# EAGLE design TeensyRF (EAGLE 6.6.0)
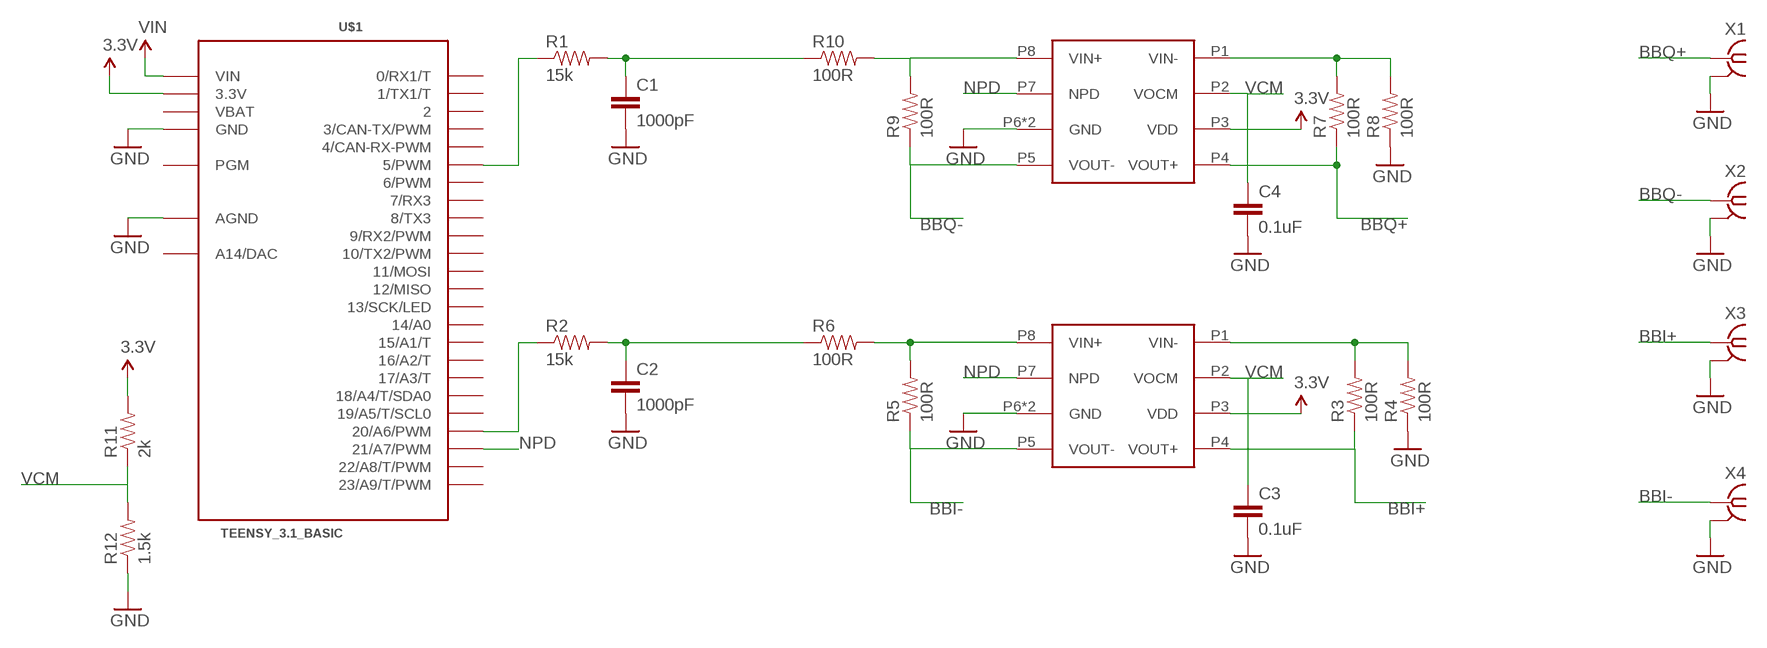
[diagram p0: schematic, sheet 1]

## Parts
C1  1000pF  CAP0805  [0805]
C2  1000pF  CAP0805  [0805]
C3  0.1uF  CAP0805  [0805]
C4  0.1uF  CAP0805  [0805]
R1  15k  RESISTOR0805-RES  [0805]
R2  15k  RESISTOR0805-RES  [0805]
R3  100R  RESISTOR0805-RES  [0805]
R4  100R  RESISTOR0805-RES  [0805]
R5  100R  RESISTOR0805-RES  [0805]
R6  100R  RESISTOR0805-RES  [0805]
R7  100R  RESISTOR0805-RES  [0805]
R8  100R  RESISTOR0805-RES  [0805]
R9  100R  RESISTOR0805-RES  [0805]
R10  100R  RESISTOR0805-RES  [0805]
R11  2k  RESISTOR0805-RES  [0805]
R12  1.5k  RESISTOR0805-RES  [0805]
U$1  TEENSY_3.1_BASIC  [TEENSY_3.1_BASIC]
U$2  THS4120  [POWERPAD-MSOP-8]
U$3  THS4120  [POWERPAD-MSOP-8]
X1  SMA-142-0701-801/806  [J502-ND-142-0701-801/806]
X2  SMA-142-0701-801/806  [J502-ND-142-0701-801/806]
X3  SMA-142-0701-801/806  [J502-ND-142-0701-801/806]
X4  SMA-142-0701-801/806  [J502-ND-142-0701-801/806]

## Nets
3.3V: R11.2 U$1.3.3V U$1.3.3V1(3.3V) U$2.P3(VDD) U$3.P3(VDD)
BBI+: R3.1 U$3.P4(VOUT+) X3.1
BBI-: R5.1 U$3.P5(VOUT-) X4.1
BBQ+: R7.1 U$2.P4(VOUT+) X1.1
BBQ-: R9.1 U$2.P5(VOUT-) X2.1
GND: C1.2 C2.2 C3.2 C4.2 R4.1 R8.1 R12.1 U$1.AGND U$1.GND U$1.GND1(GND) U$2.P6(GND) U$2.PAD(GND) U$3.P6(GND) U$3.PAD(GND) X1.G@1 X1.G@2 X1.G@3 X1.G@4 X2.G@1 X2.G@2 X2.G@3 X2.G@4 X3.G@1 X3.G@2 X3.G@3 X3.G@4 X4.G@1 X4.G@2 X4.G@3 X4.G@4
N$1: R1.1 U$1.5(5/PWM)
N$2: C1.1 R1.2 R10.1
N$3: R2.1 U$1.20/A6(20/A6/PWM)
N$4: C2.1 R2.2 R6.1
N$6: R5.2 R6.2 U$3.P8(VIN+)
N$8: R3.2 R4.2 U$3.P1(VIN-)
N$11: R7.2 R8.2 U$2.P1(VIN-)
N$13: R9.2 R10.2 U$2.P8(VIN+)
NPD: U$1.21/A7(21/A7/PWM) U$2.P7(NPD) U$3.P7(NPD)
VCM: C3.1 C4.1 R11.1 R12.2 U$2.P2(VOCM) U$3.P2(VOCM)
VIN: U$1.VIN
Unconnected: U$1.0(0/RX1/T) U$1.1(1/TX1/T) U$1.2 U$1.3(3/CAN-TX/PWM) U$1.4(4/CAN-RX-PWM) U$1.6(6/PWM) U$1.7(7/RX3) U$1.8(8/TX3) U$1.9(9/RX2/PWM) U$1.10(10/TX2/PWM) U$1.11(11/MOSI) U$1.12(12/MISO) U$1.13(13/SCK/LED) U$1.14/A0 U$1.15/A1(15/A1/T) U$1.16/A2(16/A2/T) U$1.17/A3(17/A3/T) U$1.18/A4(18/A4/T/SDA0) U$1.19/A5(19/A5/T/SCL0) U$1.22/A8(22/A8/T/PWM) U$1.23/A9(23/A9/T/PWM) U$1.A14(A14/DAC) U$1.PGM

## Power pins joined to a net without a drawn wire
VBAT: U$1.VBAT

## Library data of the parts
C1-C4 = SparkFun-Capacitors:CAP: Capacitor Standard 0603 ceramic capacitor, and 0.1" leaded capacitor.
R1-R12 = SparkFun-Resistors:RESISTOR: Resistor Basic schematic elements and footprints for 0603, 1206, and PTH resistors.
U$1 = Teensy_3_Series_Board_v1.0:TEENSY_3.1_BASIC: Footprint for Teensy 3.1 board using all pin connections on the outer perimeter
U$2 U$3 = TeensyRF:THS4120
X1-X4 = con-coax:SMA-: SMA 50 Ohm End Launch Jack Receptacle - Round Contact Johnson Components Source: www.johnsoncomponents.com .. J502-ND.pdf; MF: JOHNSON COMPONENTS; MPN: 142-0701-801; OC_FARNELL: 1608592; OC_NEWARK: 90F2624

## Board
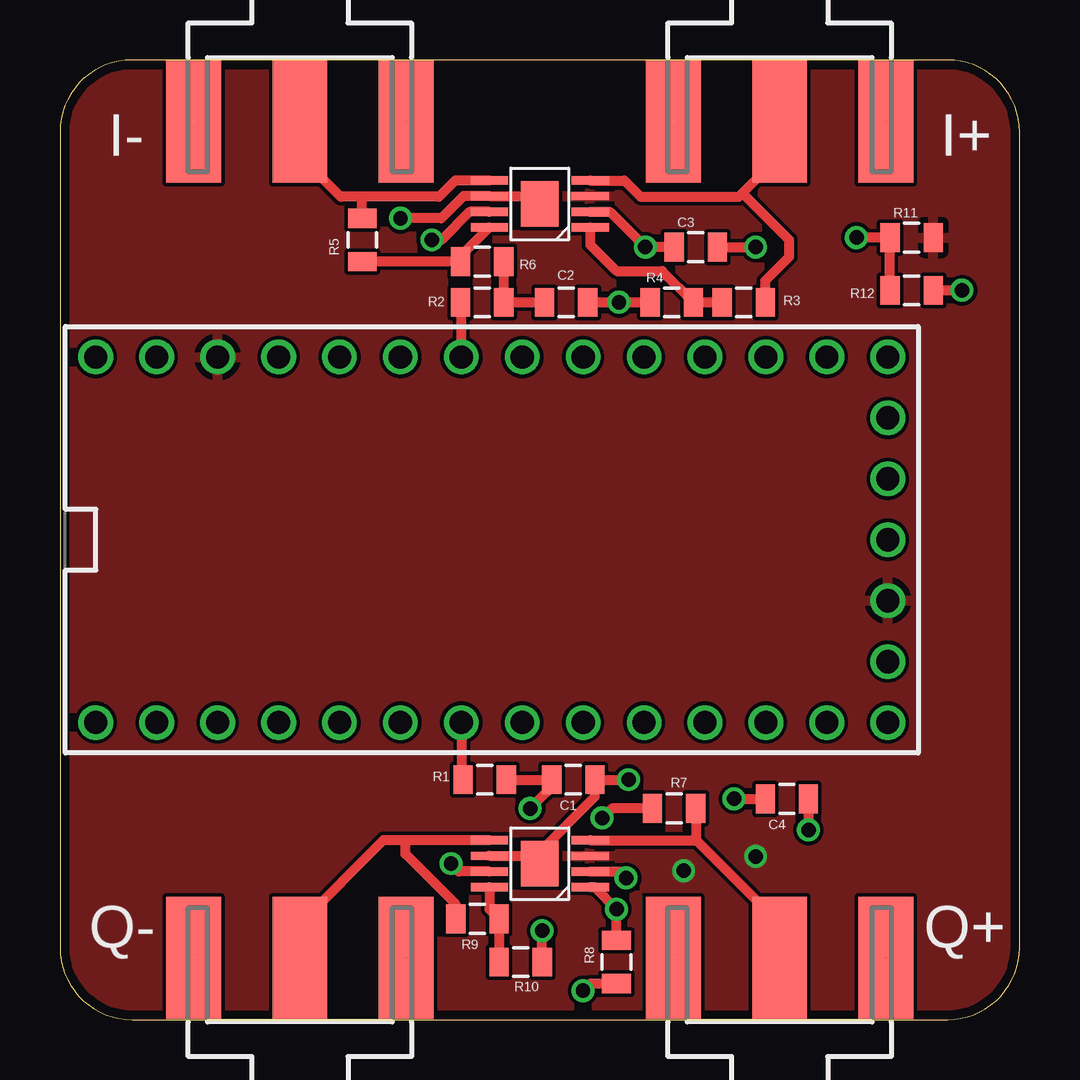
[diagram p1: board, top side]
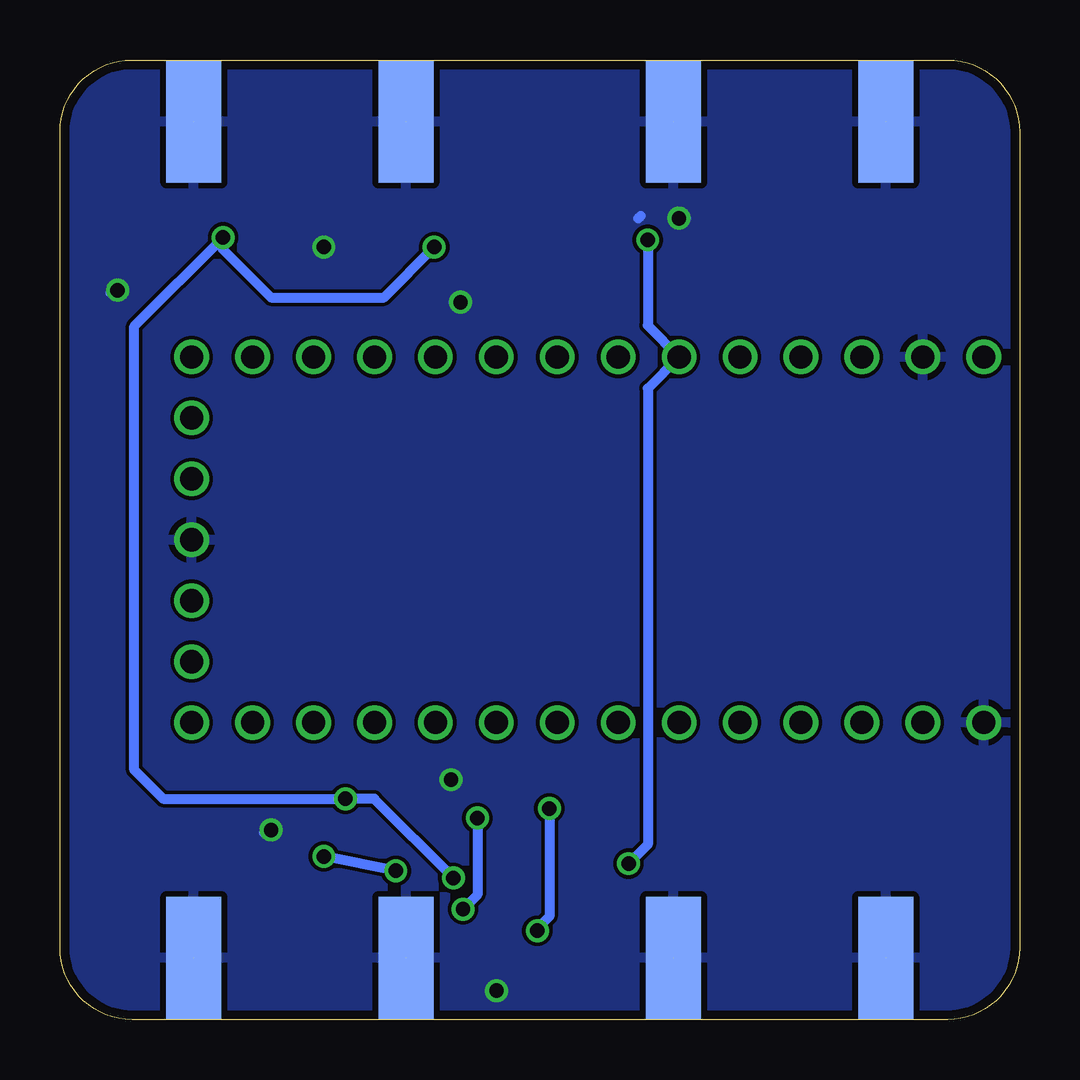
[diagram p2: board, bottom side, seen from below]

Size 40 x 40 mm. Coordinates in mm from the lower left corner, seen from the top.
Outline: 0,37 0,3 arc90 3,0 37,0 arc90 40,3 40,37 arc90 37,40 3,40 arc90 0,37
Copper layers (1*16): Top 0.0356mm / dielectric 1.5011mm / Bottom 0.0356mm
Design rules "LaenPCBOrder": minimum track width 6mil, minimum drill 13mil, track to track 6mil, track to pad 6mil, pad to pad 6mil, via to via 6mil, smd to smd 6mil, copper to edge 15mil, drill to drill 6mil, minimum pad ring 7mil, minimum via ring 7mil, stop-mask expansion 3mil, vias tented up to drill 0mil, thermal gap 10mil

### Footprints (pad centres in the part's own frame; a part is rotated, then mirrored left to right if it is on the bottom)
0805 = smd 0.8 x 1.2: 1 -0.9,0; 2 0.9,0
TEENSY_3.1_BASIC = drill 0.965: 0 -7.62,13.97; 1 -7.62,11.43; 2 -7.62,8.89; 3 -7.62,6.35; 3.3V 7.62,11.43; 3.3V1 -2.54,-16.51; 4 -7.62,3.81; 5 -7.62,1.27; 6 -7.62,-1.27; 7 -7.62,-3.81; 8 -7.62,-6.35; 9 -7.62,-8.89; 10 -7.62,-11.43; 11 -7.62,-13.97; 12 -7.62,-16.51; 13 7.62,-16.51; 14/A0 7.62,-13.97; 15/A1 7.62,-11.43; 16/A2 7.62,-8.89; 17/A3 7.62,-6.35; 18/A4 7.62,-3.81; 19/A5 7.62,-1.27; 20/A6 7.62,1.27; 21/A7 7.62,3.81; 22/A8 7.62,6.35; 23/A9 7.62,8.89; A14 5.08,-16.51; AGND 7.62,13.97; GND -7.62,16.51; GND1 0,-16.51; PGM 2.54,-16.51; VBAT -5.08,-16.51; VIN 7.62,16.51
POWERPAD-MSOP-8 = smd 1.55 x 0.35: P1 -2.1,0.975; P2 -2.1,0.325; P3 -2.1,-0.325; P4 -2.1,-0.975; P5 2.1,-0.975; P6 2.1,-0.325; P7 2.1,0.325; P8 2.1,0.975 | smd 1.57 x 1.89: PAD 0,0
J502-ND-142-0701-801/806 = smd 5.08 x 2.286: 1 2.565,0; G@1 2.565,4.42; G@2 2.565,-4.42 | smd 5.08 x 2.286 bottom: G@3 2.565,4.42; G@4 2.565,-4.42

### Placement (x,y rotation side)
C1  21.4,10 0 top
C2  21.1,29.9 0 top
C3  26.5,32.2 0 top
C4  30.3,9.2 0 top
R1  17.7,10 0 top
R2  17.6,29.9 0 top
R3  28.5,29.9 180 top
R4  25.5,29.9 0 top
R5  12.6,32.5 270 top
R6  17.6,31.6 180 top
R7  25.6,8.8 180 top
R8  23.2,2.4 90 top
R9  17.4,4.2 0 top
R10  19.2,2.4 180 top
R11  35.5,32.6 0 top
R12  35.5,30.4 180 top
U$1  18,20 90 top
U$2  20,6.5 180 top
U$3  20,34 180 top
X1  30,0 90 top
X2  10,0 90 top
X3  30,40 270 top
X4  10,40 270 top

### Tracks (layer width: path | path; a pad name or v marks a point on that pad's centre or on a via)
3.3V  (via drill 0.6)
  Bottom 0.406: v26,6.2 v29,6.8
  pour Top: 0,40 40,40 40,0 0,0
BBI+
  Top 0.406: U$3.P4 23.52,34.98 24.2,34.3 28.3,34.3 28.45,34.45 | 28.45,34.45 30,36 X3.1 | R3.1 29.4,30.8 30.4,31.8 30.4,32.5 28.45,34.45
BBI-
  Top 0.406: U$3.P5 16.48,34.98 15.8,34.3 12.6,34.3 | 12.6,34.3 11.7,34.3 10,36 X4.1 | R5.1 12.6,34.3
BBQ+
  Top 0.406: U$2.P4 26.4,7.47 | 26.4,7.47 26.52,7.47 30,4 X1.1 | R7.1 26.5,7.58 26.4,7.47
BBQ-
  Top 0.406: U$2.P5 14.4,7.47 | 14.4,7.47 13.47,7.47 10,4 X2.1 | R9.1 16.5,4.8 14.4,6.9 14.4,7.47
GND  (via drill 0.6)  (8 unrouted)
  Top 0.406: v23.7,10 C1.2 22.3,9.3 20,7 U$2.PAD 19.68,6.83 U$2.P6 | C2.2 v23.3,29.9 R4.1 | v14.2,33.4 15.9,33.4 16.82,34.33 U$3.P6 19.68,34.33 U$3.PAD | C3.2 v29,32.2 | R8.1 22.1,1.5 v21.8,1.2 | R12.1 v37.6,30.4 | C4.2 v31.2,7.9
  Bottom 0.406: v23.3,29.9 23.5,30 23.6,29.9 | 15.9,33.4 15.8,33.5 | v14.2,33.4 13.9,33.4 | v29,32.2 29.2,32.2 | v21.8,1.2 21.7,1.2 21.8,1.1 | v37.6,30.4 37.8,30.4 37.9,30.3 | v31.2,7.9 31.4,7.9 31.5,7.8
  pour Bottom: 0,40 40,40 40,0 0,0
N$1
  Top 0.406: U$1.5 16.73,10.03 R1.1
N$2  (via drill 0.6)
  Top 0.406: R1.2 C1.1 arc-45 20.29,9.49 v19.6,8.8 | R10.1 v20.1,3.7
  Bottom 0.406: v19.6,8.8 19.6,4.3 20.1,3.8 v20.1,3.7
N$3
  Top 0.406: U$1.20/A6 16.73,29.97 R2.1
N$4
  Top 0.406: C2.1 R2.2 R6.1
N$6
  Top 0.406: U$3.P8 16.7,31.82 R6.2 R5.2
N$8
  Top 0.406: U$3.P1 22.1,32.3 23.2,31.2 25.1,31.2 R4.2 R3.2
N$11  (via drill 0.6)
  Top 0.406: R8.2 v23.2,4.6 22.27,5.53 U$2.P1 | R7.2 23,8.8 v22.6,8.4
  Bottom 0.406: v22.6,8.4 22.6,5.2 v23.2,4.6
N$13
  Top 0.406: U$2.P8 17.9,4.6 R9.2 R10.2
NPD  (via drill 0.6)
  Top 0.406: U$3.P7 17.07,33.67 15.9,32.5 v15.5,32.5 | U$2.P7 16.62,6.17 v16.3,6.5
  Bottom 0.406: v15.5,32.5 15.5,28.93 U$1.21/A7 15.5,26.31 15.5,7.3 v16.3,6.5
VCM  (via drill 0.6)
  Top 0.406: U$3.P2 22.93,33.67 v24.4,32.2 C3.1 | R12.2 R11.1 v33.2,32.6 | U$2.P2 23.32,6.17 v23.6,5.9 | v28.1,9.2 C4.1
  Bottom 0.406: v24.4,32.2 26.5,30.1 31.2,30.1 33.2,32.1 v33.2,32.6 36.9,28.9 36.9,10.4 35.7,9.2 v28.1,9.2 26.9,9.2 v23.6,5.9

### Text on the board
tNames: I- | I+ | Q- | Q+